# Altium project 20230223_HomeWork_LedCube_LongNhi_Altium23.1.PrjPcb
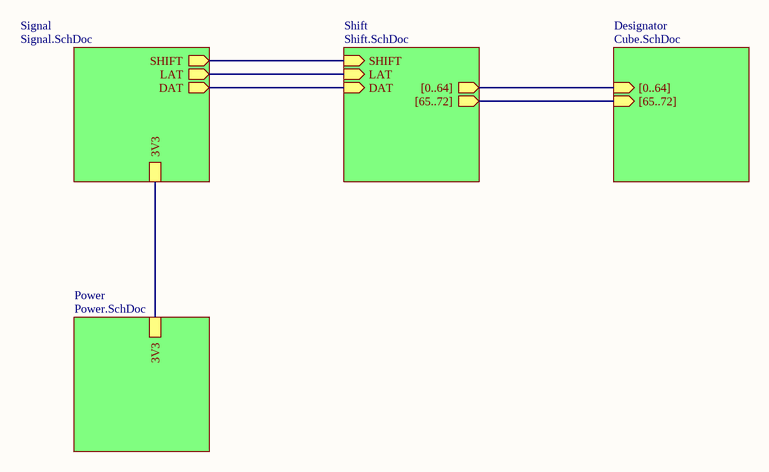
[diagram p0: MotherSheet.SchDoc]
5 sheets, 47 parts. Net scope: hierarchical (ports join the sheet entries above them; power ports are global).
Board file: PCB1.PcbDoc
Sheets:
  MotherSheet.SchDoc
    Signal = Signal.SchDoc
    Power = Power.SchDoc
    Shift = Shift.SchDoc
    Designator = Cube.SchDoc

## Sheet MotherSheet.SchDoc
size A; SheetNumber: 1; SheetTotal: 5

### Sub-sheets
Designator = Cube.SchDoc: [0..64] (in), [65..72] (in)
Power = Power.SchDoc: 3V3
Shift = Shift.SchDoc: SHIFT (in), LAT (in), DAT (in), [0..64] (out), [65..72] (out)
Signal = Signal.SchDoc: 3V3, DAT (out), LAT (out), SHIFT (out)

### Nets
DAT: sheet Signal/DAT, sheet Shift/DAT
LAT: sheet Signal/LAT, sheet Shift/LAT
SHIFT: sheet Signal/SHIFT, sheet Shift/SHIFT
NetBT1_5: sheet Signal/3V3, sheet Power/3V3

### Buses and harness runs
bus sheet Designator/[0..64] = sheet Shift/[0..64]
bus sheet Designator/[65..72] = sheet Shift/[65..72]

## Sheet Signal.SchDoc
size A4; SheetNumber: 2; SheetTotal: 5
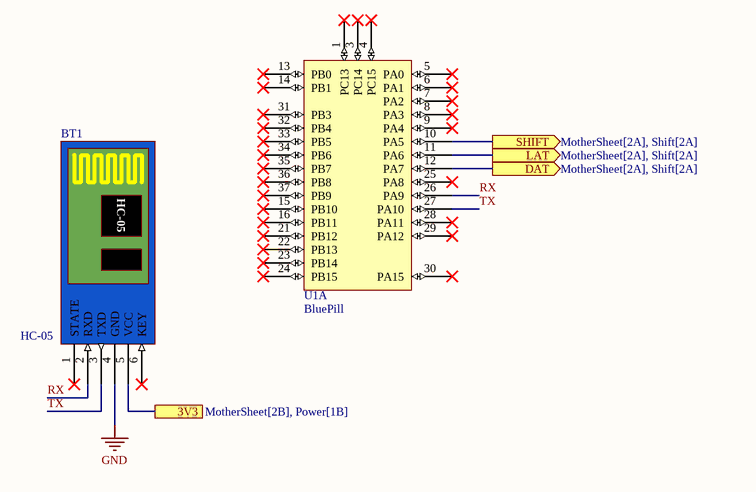
[diagram p1: Signal.SchDoc]

### Parts
BT1  HC-05  [HC-05]
U1  BluePill  [BluePill]  (part A of 2)

### Ports
3V3 (see MotherSheet[2B], Power[1B]), DAT (out, see MotherSheet[2A], Shift[2A]), LAT (out, see MotherSheet[2A], Shift[2A]), SHIFT (out, see MotherSheet[2A], Shift[2A])

### Nets
GND: BT1.4(GND)
DAT: U1.12(PA7) ; port DAT
LAT: U1.11(PA6) ; port LAT
RX: BT1.2(RXD) U1.26(PA9)
SHIFT: U1.10(PA5) ; port SHIFT
TX: BT1.3(TXD) U1.27(PA10)
NetBT1_5: BT1.5(VCC) ; port 3V3

Not connected (* = marked no-connect by the designer): BT1 1(STATE)* 6(KEY)*; U1 1(PC13)* 3(PC14)* 4(PC15)* 5(PA0)* 6(PA1)* 7(PA2)* 8(PA3)* 9(PA4)* 13(PB0)* 14(PB1)* 15(PB10)* 16(PB11)* 21(PB12)* 22(PB13)* 23(PB14)* 24(PB15)* 25(PA8)* 28(PA11)* 29(PA12)* 30(PA15)* 31(PB3)* 32(PB4)* 33(PB5)* 34(PB6)* 35(PB7)* 36(PB8)* 37(PB9)*

### Library data of the parts
U1 = BluePill: STM32F103C8T6, mbed-Enabled Development Bluepill STM32F1 ARM® Cortex®-M3 MCU 32-Bit Embedded Evaluation Board; Processor: STM32F103C9T6; Operating/input voltage: 3.3V; CPU speed: 72MHz; Analog pins: 10; Digital IO/PWM: 37; EEPROM/SRAM(KB): -/20; Flash: 64/128K; USB Connector: Micro; UART: 3; SPI: 2; I2C: 2; ComponentLink1Description: Datasheet; ComponentLink1URL: https://components101.com/microcontrollers/stm32f103c8t8-blue-pill-development-board; ComponentLink2Description: Hshop; ComponentLink2URL: https://hshop.vn/products/kit-ra-chon-stm32f103c8t6; ComponentLink3Description: Banlinhkien; ComponentLink3URL: https://banlinhkien.com/kit-stm32f103c8t6-board-mini-p6649312.html
BT1 = HC-05: ComponentLink1Description: Datasheet; ComponentLink1URL: https://www.etechnophiles.com/wp-content/uploads/2020/10/HC-05-Datasheet-Download.pdf; ComponentLink2Description: Hshop; ComponentLink2URL: https://hshop.vn/products/mach-thu-phat-bluetooth-hc-05-do-ra-chon-master; ComponentLink3Description: Banlinhkien; ComponentLink3URL: https://banlinhkien.com/module-bluetooth-hc05-p6647275.html; ComponentLink4Description: ICDayroi; ComponentLink4URL: https://icdayroi.com/module-thu-phat-bluetooth-hc-05

## Sheet Power.SchDoc
size OrCAD A portrait; SheetNumber: 3; SheetTotal: 5
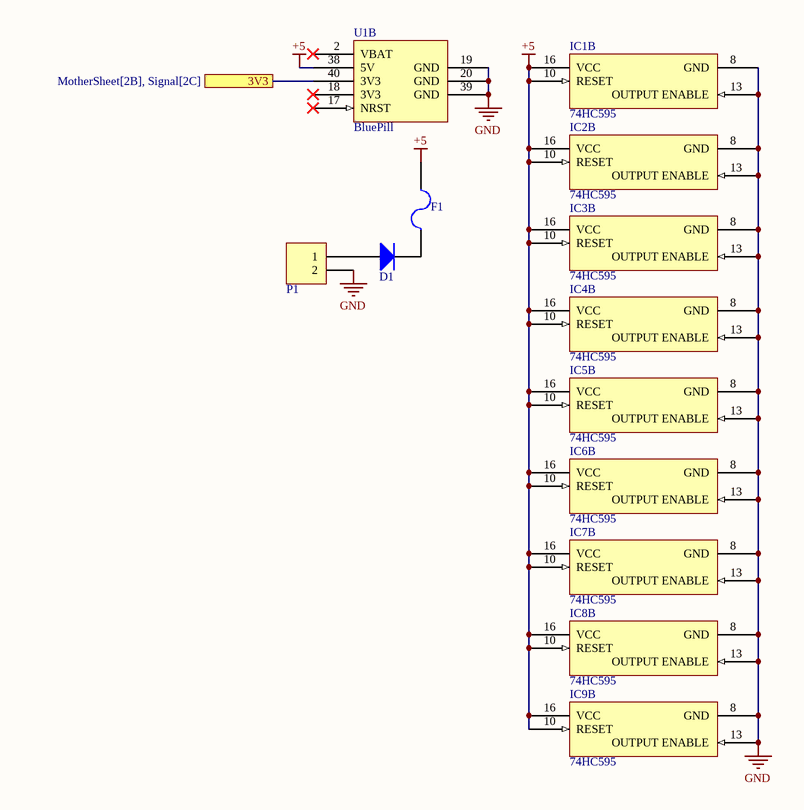
[diagram p2: Power.SchDoc]

### Parts
D1  Diode  [D1A]  (value not drawn)
F1  Fuse  [FUSE SMD]  (value not drawn)
IC1  74HC595  [74HC595]  (part B of 2)
IC2  74HC595  [74HC595]  (part B of 2)
IC3  74HC595  [74HC595]  (part B of 2)
IC4  74HC595  [74HC595]  (part B of 2)
IC5  74HC595  [74HC595]  (part B of 2)
IC6  74HC595  [74HC595]  (part B of 2)
IC7  74HC595  [74HC595]  (part B of 2)
IC8  74HC595  [74HC595]  (part B of 2)
IC9  74HC595  [74HC595]  (part B of 2)
P1  Domino 2  [DOMINO 2- 5mm]  (value not drawn)
U1  BluePill  [BluePill]  (part B of 2)

### Ports
3V3 (see MotherSheet[2B], Signal[2C])

### Nets
+5: F1.2 IC1.10(RESET) IC1.16(VCC) IC2.10(RESET) IC2.16(VCC) IC3.10(RESET) IC3.16(VCC) IC4.10(RESET) IC4.16(VCC) IC5.10(RESET) IC5.16(VCC) IC6.10(RESET) IC6.16(VCC) IC7.10(RESET) IC7.16(VCC) IC8.10(RESET) IC8.16(VCC) IC9.10(RESET) IC9.16(VCC) U1.38(5V)
GND: IC1.8(GND) IC1.13(OUTPUT_ENABLE) IC2.8(GND) IC2.13(OUTPUT_ENABLE) IC3.8(GND) IC3.13(OUTPUT_ENABLE) IC4.8(GND) IC4.13(OUTPUT_ENABLE) IC5.8(GND) IC5.13(OUTPUT_ENABLE) IC6.8(GND) IC6.13(OUTPUT_ENABLE) IC7.8(GND) IC7.13(OUTPUT_ENABLE) IC8.8(GND) IC8.13(OUTPUT_ENABLE) IC9.8(GND) IC9.13(OUTPUT_ENABLE) P1.2 U1.19(GND) U1.20(GND) U1.39(GND)
NetBT1_5: U1.40(3V3) ; port 3V3
NetD1_1: D1.1(A) P1.1
NetD1_2: D1.2(K) F1.1

Not connected (* = marked no-connect by the designer): U1 2(VBAT)* 17(NRST)* 18(3V3)*

### Library data of the parts
D1 = Diode: Default Diode
IC1-IC9 = 74HC595: Logic Type: Shift Register; Number of Elements: 1; Number of Bits per Element: 8; Function: Serial to Parallel, Serial; Voltage - Supply: 2V ~ 6V; Output Type: Output Type; Operating Temperature: -55°C ~ 125°C; Package / Case: 16-DIP (0.300", 7.62mm); ComponentLink1Description: Banlinhkien; ComponentLink1URL: https://banlinhkien.com/74hc595-dip16-p6648401.html; ComponentLink2Description: Datasheet; ComponentLink2URL: https://pdf1.alldatasheet.com/datasheet-pdf/view/23121/STMICROELECTRONICS/74HC595.html; ComponentLink3Description: ICDayroi; ComponentLink3URL: https://icdayroi.com/74hc595n
P1 = Domino 2: Domino, 2-Pin; LatestRevisionDate: 17-Jul-2002; LatestRevisionNote: Re-released for DXP Platform.; Publisher: Altium Limited
U1 = BluePill: as U1 on sheet Signal; I2C: 2; ComponentLink1Description: Datasheet; ComponentLink1URL: https://components101.com/microcontrollers/stm32f103c8t8-blue-pill-development-board; ComponentLink2Description: Hshop; ComponentLink2URL: https://hshop.vn/products/kit-ra-chon-stm32f103c8t6; ComponentLink3Description: Banlinhkien; ComponentLink3URL: https://banlinhkien.com/kit-stm32f103c8t6-board-mini-p6649312.html

## Sheet Shift.SchDoc
size Legal portrait; SheetNumber: 4; SheetTotal: 4
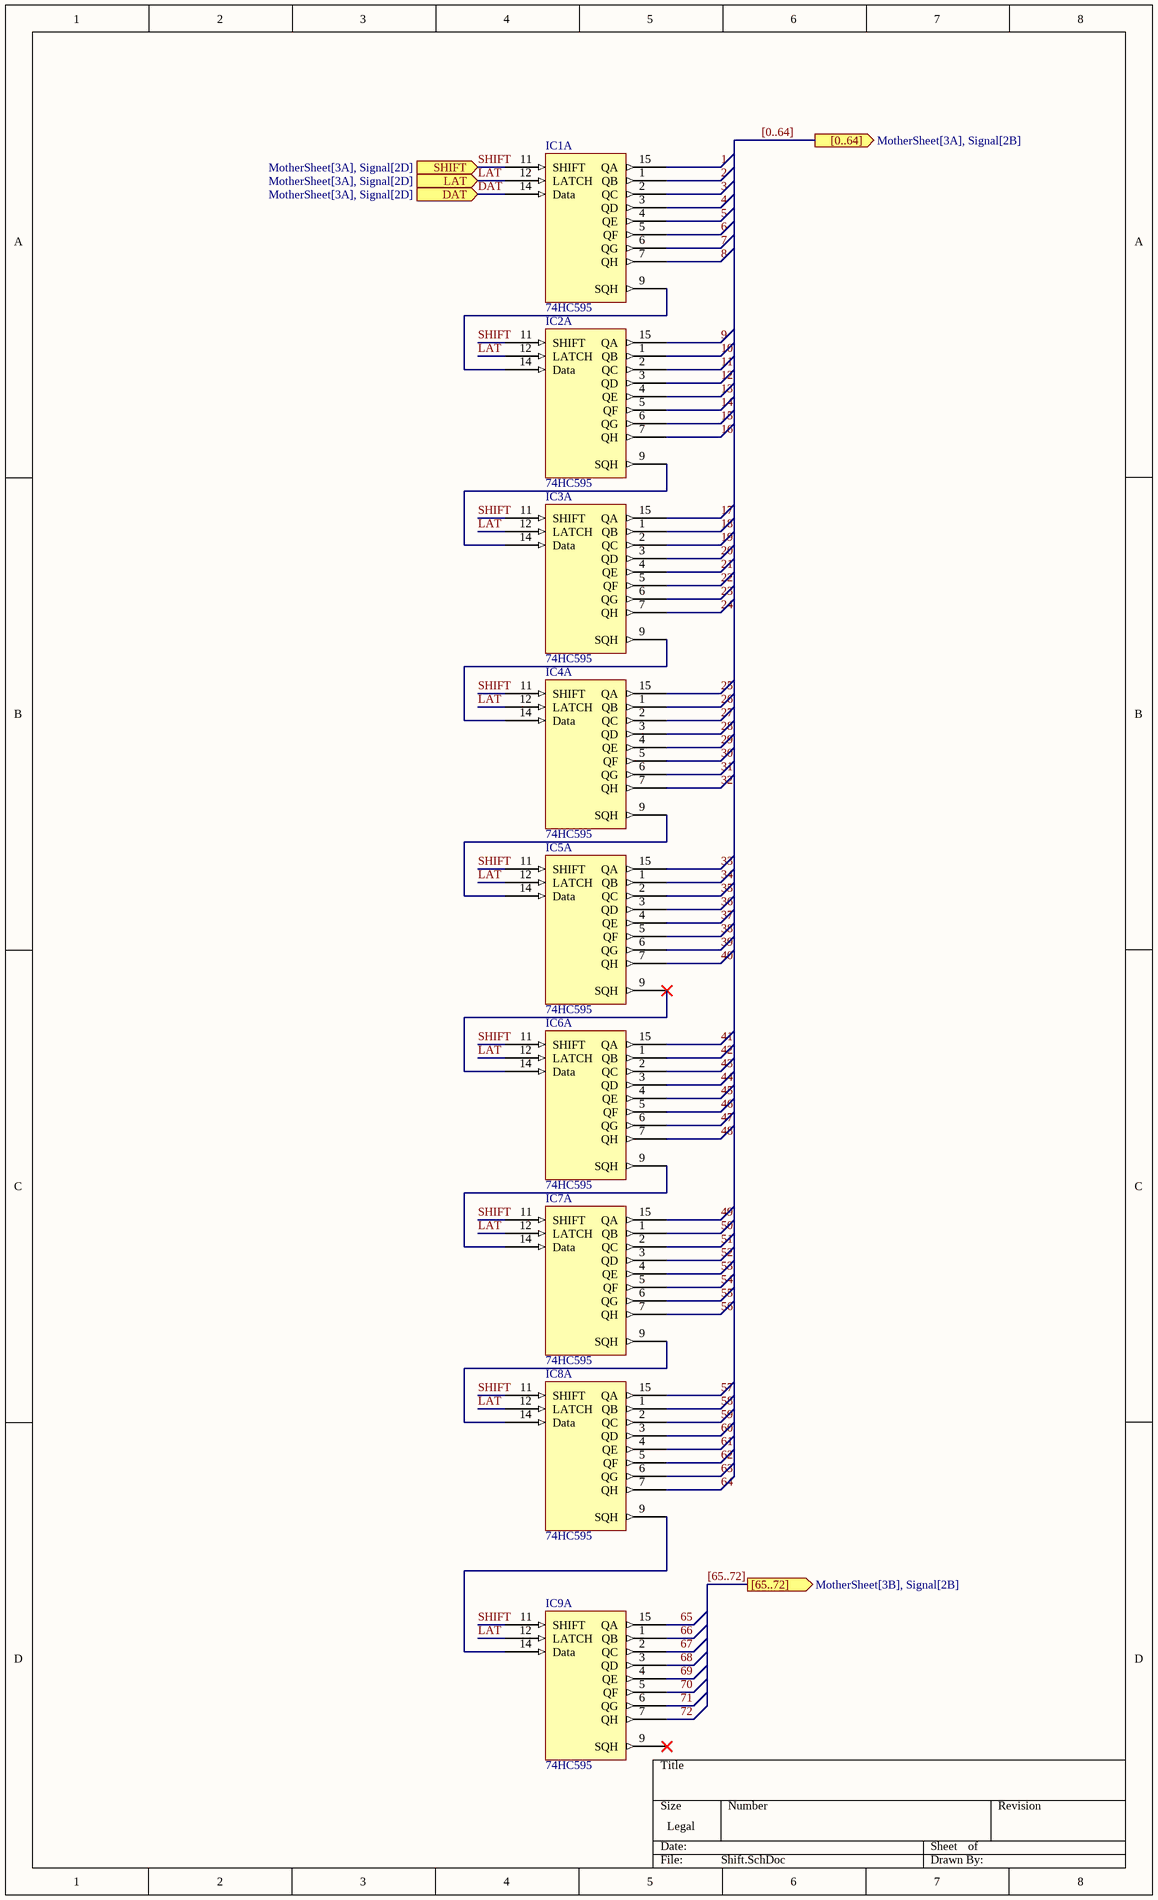
[diagram p3: Shift.SchDoc]

### Parts
IC1  74HC595  [74HC595]  (part A of 2)
IC2  74HC595  [74HC595]  (part A of 2)
IC3  74HC595  [74HC595]  (part A of 2)
IC4  74HC595  [74HC595]  (part A of 2)
IC5  74HC595  [74HC595]  (part A of 2)
IC6  74HC595  [74HC595]  (part A of 2)
IC7  74HC595  [74HC595]  (part A of 2)
IC8  74HC595  [74HC595]  (part A of 2)
IC9  74HC595  [74HC595]  (part A of 2)

### Ports
[0..64] (out, see MotherSheet[3A], Signal[2B]), [65..72] (out, see MotherSheet[3B], Signal[2B]), DAT (in, see MotherSheet[3A], Signal[2D]), LAT (in, see MotherSheet[3A], Signal[2D]), SHIFT (in, see MotherSheet[3A], Signal[2D])

### Nets
1: IC1.15(QA)
2: IC1.1(QB)
3: IC1.2(QC)
4: IC1.3(QD)
5: IC1.4(QE)
6: IC1.5(QF)
7: IC1.6(QG)
8: IC1.7(QH)
9: IC2.15(QA)
10: IC2.1(QB)
11: IC2.2(QC)
12: IC2.3(QD)
13: IC2.4(QE)
14: IC2.5(QF)
15: IC2.6(QG)
16: IC2.7(QH)
17: IC3.15(QA)
18: IC3.1(QB)
19: IC3.2(QC)
20: IC3.3(QD)
21: IC3.4(QE)
22: IC3.5(QF)
23: IC3.6(QG)
24: IC3.7(QH)
25: IC4.15(QA)
26: IC4.1(QB)
27: IC4.2(QC)
28: IC4.3(QD)
29: IC4.4(QE)
30: IC4.5(QF)
31: IC4.6(QG)
32: IC4.7(QH)
33: IC5.15(QA)
34: IC5.1(QB)
35: IC5.2(QC)
36: IC5.3(QD)
37: IC5.4(QE)
38: IC5.5(QF)
39: IC5.6(QG)
40: IC5.7(QH)
41: IC6.15(QA)
42: IC6.1(QB)
43: IC6.2(QC)
44: IC6.3(QD)
45: IC6.4(QE)
46: IC6.5(QF)
47: IC6.6(QG)
48: IC6.7(QH)
49: IC7.15(QA)
50: IC7.1(QB)
51: IC7.2(QC)
52: IC7.3(QD)
53: IC7.4(QE)
54: IC7.5(QF)
55: IC7.6(QG)
56: IC7.7(QH)
57: IC8.15(QA)
58: IC8.1(QB)
59: IC8.2(QC)
60: IC8.3(QD)
61: IC8.4(QE)
62: IC8.5(QF)
63: IC8.6(QG)
64: IC8.7(QH)
65: IC9.15(QA)
66: IC9.1(QB)
67: IC9.2(QC)
68: IC9.3(QD)
69: IC9.4(QE)
70: IC9.5(QF)
71: IC9.6(QG)
72: IC9.7(QH)
DAT: IC1.14(Data) ; port DAT
LAT: IC1.12(LATCH) IC2.12(LATCH) IC3.12(LATCH) IC4.12(LATCH) IC5.12(LATCH) IC6.12(LATCH) IC7.12(LATCH) IC8.12(LATCH) IC9.12(LATCH) ; port LAT
SHIFT: IC1.11(SHIFT) IC2.11(SHIFT) IC3.11(SHIFT) IC4.11(SHIFT) IC5.11(SHIFT) IC6.11(SHIFT) IC7.11(SHIFT) IC8.11(SHIFT) IC9.11(SHIFT) ; port SHIFT
NetIC1_9: IC1.9(SQH) IC2.14(Data)
NetIC2_9: IC2.9(SQH) IC3.14(Data)
NetIC3_9: IC3.9(SQH) IC4.14(Data)
NetIC4_9: IC4.9(SQH) IC5.14(Data)
NetIC5_9: IC5.9(SQH) IC6.14(Data)
NetIC6_9: IC6.9(SQH) IC7.14(Data)
NetIC7_9: IC7.9(SQH) IC8.14(Data)
NetIC8_9: IC8.9(SQH) IC9.14(Data)

Not connected (* = marked no-connect by the designer): IC9 9(SQH)*

### Buses and harness runs
bus [0..64] = port [0..64]
bus [65..72] = port [65..72]

### Library data of the parts
IC1-IC9 = 74HC595: as IC1 on sheet Power; Output Type: Output Type; Operating Temperature: -55°C ~ 125°C; Package / Case: 16-DIP (0.300", 7.62mm); ComponentLink1Description: Banlinhkien; ComponentLink1URL: https://banlinhkien.com/74hc595-dip16-p6648401.html; ComponentLink2Description: Datasheet; ComponentLink2URL: https://pdf1.alldatasheet.com/datasheet-pdf/view/23121/STMICROELECTRONICS/74HC595.html; ComponentLink3Description: ICDayroi; ComponentLink3URL: https://icdayroi.com/74hc595n

## Sheet Cube.SchDoc
size A4; SheetNumber: 5; SheetTotal: 5
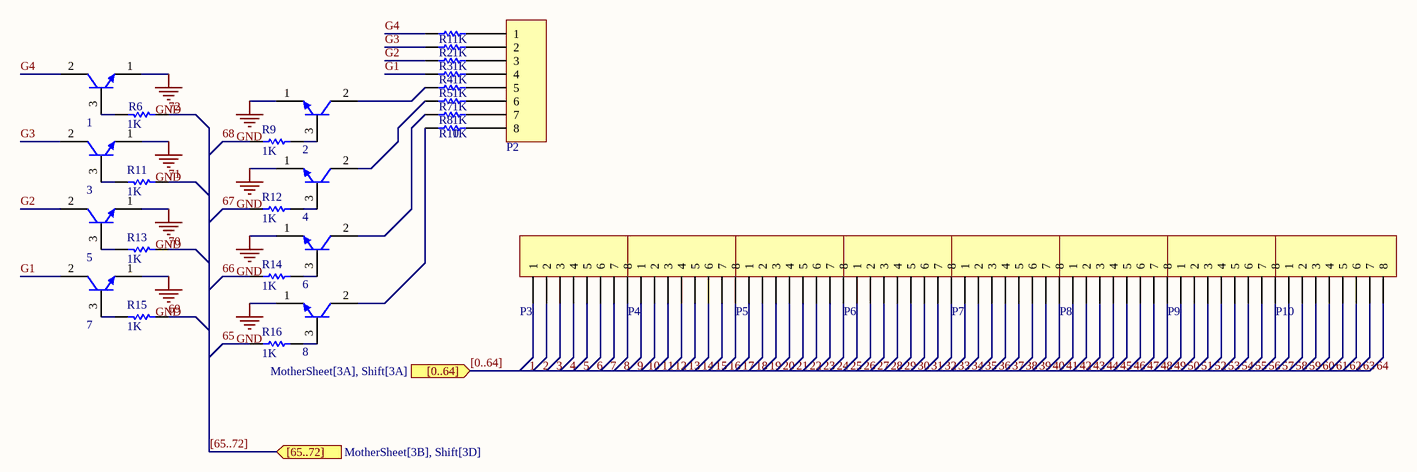
[diagram p4: Cube.SchDoc]

### Parts
1  C1815  [QTO-92]  (value not drawn)
2  C1815  [QTO-92]  (value not drawn)
3  C1815  [QTO-92]  (value not drawn)
4  C1815  [QTO-92]  (value not drawn)
5  C1815  [QTO-92]  (value not drawn)
6  C1815  [QTO-92]  (value not drawn)
7  C1815  [QTO-92]  (value not drawn)
8  C1815  [QTO-92]  (value not drawn)
P2  Header 8  [JP8]  (value not drawn)
P3  Header 8  [JP8]  (value not drawn)
P4  Header 8  [JP8]  (value not drawn)
P5  Header 8  [JP8]  (value not drawn)
P6  Header 8  [JP8]  (value not drawn)
P7  Header 8  [JP8]  (value not drawn)
P8  Header 8  [JP8]  (value not drawn)
P9  Header 8  [JP8]  (value not drawn)
P10  Header 8  [JP8]  (value not drawn)
R1  value 1K  [RES 1/2W]  (hidden comment: RESISTOR)
R2  value 1K  [RES 1/2W]  (hidden comment: RESISTOR)
R3  value 1K  [RES 1/2W]  (hidden comment: RESISTOR)
R4  value 1K  [RES 1/2W]  (hidden comment: RESISTOR)
R5  value 1K  [RES 1/2W]  (hidden comment: RESISTOR)
R6  value 1K  [RES 1/2W]  (hidden comment: RESISTOR)
R7  value 1K  [RES 1/2W]  (hidden comment: RESISTOR)
R8  value 1K  [RES 1/2W]  (hidden comment: RESISTOR)
R9  value 1K  [RES-SM-0805]  (hidden comment: RESISTOR SMD)
R10  value 1K  [RES 1/2W]  (hidden comment: RESISTOR)
R11  value 1K  [RES 1/2W]  (hidden comment: RESISTOR)
R12  value 1K  [RES 1/2W]  (hidden comment: RESISTOR)
R13  value 1K  [RES 1/2W]  (hidden comment: RESISTOR)
R14  value 1K  [RES 1/2W]  (hidden comment: RESISTOR)
R15  value 1K  [RES 1/2W]  (hidden comment: RESISTOR)
R16  value 1K  [RES 1/2W]  (hidden comment: RESISTOR)

### Ports
[0..64] (in, see MotherSheet[3A], Shift[3A]), [65..72] (in, see MotherSheet[3B], Shift[3D])

### Nets
GND: 1.1(E) 2.1(E) 3.1(E) 4.1(E) 5.1(E) 6.1(E) 7.1(E) 8.1(E)
1: P3.1
2: P3.2
3: P3.3
4: P3.4
5: P3.5
6: P3.6
7: P3.7
8: P3.8
9: P4.1
10: P4.2
11: P4.3
12: P4.4
13: P4.5
14: P4.6
15: P4.7
16: P4.8
17: P5.1
18: P5.2
19: P5.3
20: P5.4
21: P5.5
22: P5.6
23: P5.7
24: P5.8
25: P6.1
26: P6.2
27: P6.3
28: P6.4
29: P6.5
30: P6.6
31: P6.7
32: P6.8
33: P7.1
34: P7.2
35: P7.3
36: P7.4
37: P7.5
38: P7.6
39: P7.7
40: P7.8
41: P8.1
42: P8.2
43: P8.3
44: P8.4
45: P8.5
46: P8.6
47: P8.7
48: P8.8
49: P9.1
50: P9.2
51: P9.3
52: P9.4
53: P9.5
54: P9.6
55: P9.7
56: P9.8
57: P10.1
58: P10.2
59: P10.3
60: P10.4
61: P10.5
62: P10.6
63: P10.7
64: P10.8
65: R16.1
66: R14.1
67: R12.1
68: R9.1
69: R15.1
70: R13.1
71: R11.1
72: R6.1
G1: 7.2(C) R4.1
G2: 5.2(C) R3.1
G3: 3.2(C) R2.1
G4: 1.2(C) R1.1
Net1_3: 1.3(B) R6.2
Net2_2: 2.2(C) R5.1
Net2_3: 2.3(B) R9.2
Net3_3: 3.3(B) R11.2
Net4_2: 4.2(C) R7.1
Net4_3: 4.3(B) R12.2
Net5_3: 5.3(B) R13.2
Net6_2: 6.2(C) R8.1
Net6_3: 6.3(B) R14.2
Net7_3: 7.3(B) R15.2
Net8_2: 8.2(C) R10.1
Net8_3: 8.3(B) R16.2
NetP2_1: P2.1 R1.2
NetP2_2: P2.2 R2.2
NetP2_3: P2.3 R3.2
NetP2_4: P2.4 R4.2
NetP2_5: P2.5 R5.2
NetP2_6: P2.6 R7.2
NetP2_7: P2.7 R8.2
NetP2_8: P2.8 R10.2

### Buses and harness runs
bus [0..64] = port [0..64]
bus [65..72] = port [65..72]

### Library data of the parts
1-8 = C1815: NPN Bipolar Transistor
P2-P10 = Header 8: Header, 8-Pin; LatestRevisionDate: 17-Jul-2002; LatestRevisionNote: Re-released for DXP Platform.; Publisher: Altium Limited
R9 = RESISTOR SMD: Resistor

## Nets that join several sheets
GND: Signal (BT1.4), Power (22 pins), Cube (8 pins)
1: Shift (IC1.15), Cube (P3.1)
2: Shift (IC1.1), Cube (P3.2)
3: Shift (IC1.2), Cube (P3.3)
4: Shift (IC1.3), Cube (P3.4)
5: Shift (IC1.4), Cube (P3.5)
6: Shift (IC1.5), Cube (P3.6)
7: Shift (IC1.6), Cube (P3.7)
8: Shift (IC1.7), Cube (P3.8)
9: Shift (IC2.15), Cube (P4.1)
10: Shift (IC2.1), Cube (P4.2)
11: Shift (IC2.2), Cube (P4.3)
12: Shift (IC2.3), Cube (P4.4)
13: Shift (IC2.4), Cube (P4.5)
14: Shift (IC2.5), Cube (P4.6)
15: Shift (IC2.6), Cube (P4.7)
16: Shift (IC2.7), Cube (P4.8)
17: Shift (IC3.15), Cube (P5.1)
18: Shift (IC3.1), Cube (P5.2)
19: Shift (IC3.2), Cube (P5.3)
20: Shift (IC3.3), Cube (P5.4)
21: Shift (IC3.4), Cube (P5.5)
22: Shift (IC3.5), Cube (P5.6)
23: Shift (IC3.6), Cube (P5.7)
24: Shift (IC3.7), Cube (P5.8)
25: Shift (IC4.15), Cube (P6.1)
26: Shift (IC4.1), Cube (P6.2)
27: Shift (IC4.2), Cube (P6.3)
28: Shift (IC4.3), Cube (P6.4)
29: Shift (IC4.4), Cube (P6.5)
30: Shift (IC4.5), Cube (P6.6)
31: Shift (IC4.6), Cube (P6.7)
32: Shift (IC4.7), Cube (P6.8)
33: Shift (IC5.15), Cube (P7.1)
34: Shift (IC5.1), Cube (P7.2)
35: Shift (IC5.2), Cube (P7.3)
36: Shift (IC5.3), Cube (P7.4)
37: Shift (IC5.4), Cube (P7.5)
38: Shift (IC5.5), Cube (P7.6)
39: Shift (IC5.6), Cube (P7.7)
40: Shift (IC5.7), Cube (P7.8)
41: Shift (IC6.15), Cube (P8.1)
42: Shift (IC6.1), Cube (P8.2)
43: Shift (IC6.2), Cube (P8.3)
44: Shift (IC6.3), Cube (P8.4)
45: Shift (IC6.4), Cube (P8.5)
46: Shift (IC6.5), Cube (P8.6)
47: Shift (IC6.6), Cube (P8.7)
48: Shift (IC6.7), Cube (P8.8)
49: Shift (IC7.15), Cube (P9.1)
50: Shift (IC7.1), Cube (P9.2)
51: Shift (IC7.2), Cube (P9.3)
52: Shift (IC7.3), Cube (P9.4)
53: Shift (IC7.4), Cube (P9.5)
54: Shift (IC7.5), Cube (P9.6)
55: Shift (IC7.6), Cube (P9.7)
56: Shift (IC7.7), Cube (P9.8)
57: Shift (IC8.15), Cube (P10.1)
58: Shift (IC8.1), Cube (P10.2)
59: Shift (IC8.2), Cube (P10.3)
60: Shift (IC8.3), Cube (P10.4)
61: Shift (IC8.4), Cube (P10.5)
62: Shift (IC8.5), Cube (P10.6)
63: Shift (IC8.6), Cube (P10.7)
64: Shift (IC8.7), Cube (P10.8)
65: Shift (IC9.15), Cube (R16.1)
66: Shift (IC9.1), Cube (R14.1)
67: Shift (IC9.2), Cube (R12.1)
68: Shift (IC9.3), Cube (R9.1)
69: Shift (IC9.4), Cube (R15.1)
70: Shift (IC9.5), Cube (R13.1)
71: Shift (IC9.6), Cube (R11.1)
72: Shift (IC9.7), Cube (R6.1)
DAT: Signal (U1.12), Shift (IC1.14)
LAT: Signal (U1.11), Shift (9 pins)
NetBT1_5: Signal (BT1.5), Power (U1.40)
SHIFT: Signal (U1.10), Shift (9 pins)